# Altium schematic sheet Sheet6.SchDoc
size A4; SheetNumber: 6; SheetTotal: 6
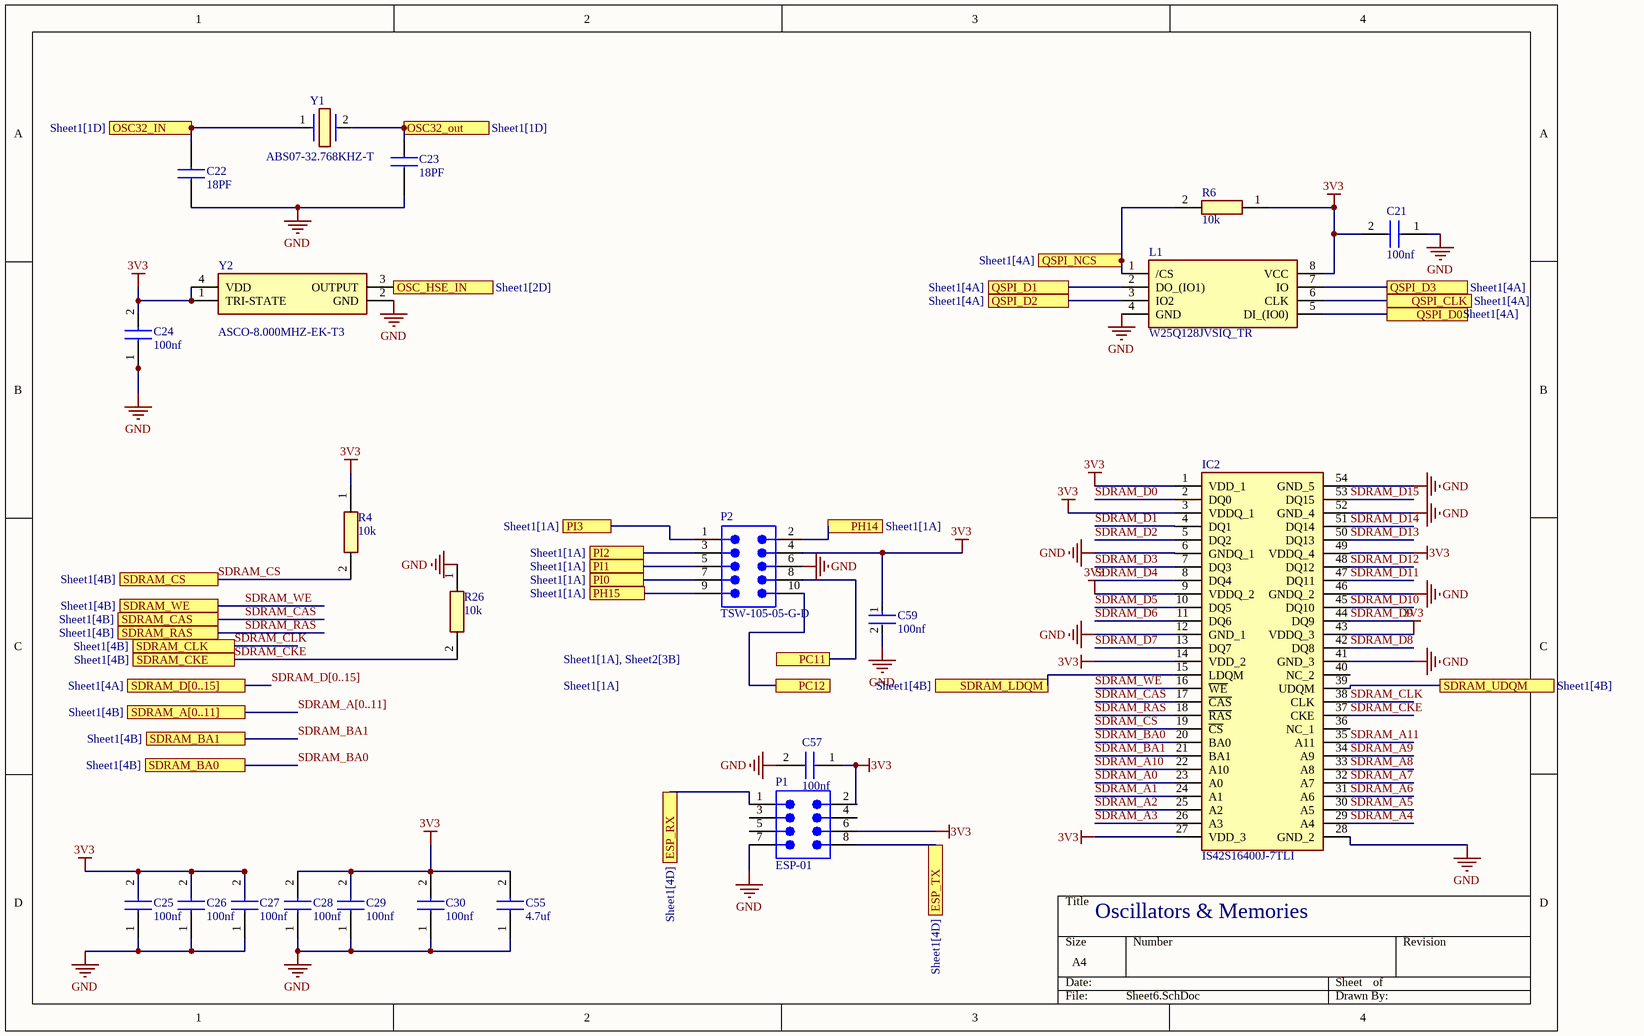
[diagram p0: Sheet6.SchDoc]

## Parts
C21  100nf  [CAPC1608X95N]
C22  18PF  [CAPC1608X87N]
C23  18PF  [CAPC1608X87N]
C24  100nf  [CAPC1608X95N]
C25  100nf  [CAPC1608X95N]
C26  100nf  [CAPC1608X95N]
C27  100nf  [CAPC1608X95N]
C28  100nf  [CAPC1608X95N]
C29  100nf  [CAPC1608X95N]
C30  100nf  [CAPC1608X95N]
C55  4.7uf  [CAPC1608X95N]
C57  100nf  [CAPC1608X95N]
C59  100nf  [FP-VJ0603X-MFG]
IC2  IS42S16400J-7TLI  [SOP80P1176X120-54N]
L1  W25Q128JVSIQ_TR  [SOIC127P780X195-8N]
P1  ESP-01  [SMTC-MTSW-104-12-X-D-006]
P2  TSW-105-05-G-D  [SMTC-TSW-105-05-X-D]
R4  10k  [RESC1608X55N]
R6  10k  [RESC1608X55N]
R26  10k  [RESC1608X55N]
Y1  ABS07-32.768KHZ-T  [ABS07]
Y2  ASCO-8.000MHZ-EK-T3  [ASCO16000MHZEKT]

## Ports
ESP_RX (see Sheet1[4D]), ESP_TX (see Sheet1[4D]), OSC32_IN (see Sheet1[1D]), OSC32_out (see Sheet1[1D]), OSC_HSE_IN (see Sheet1[2D]), PC11 (see Sheet1[1A], Sheet2[3B]), PC12 (see Sheet1[1A]), PH14 (see Sheet1[1A]), PH15 (see Sheet1[1A]), PI0 (see Sheet1[1A]), PI1 (see Sheet1[1A]), PI2 (see Sheet1[1A]), PI3 (see Sheet1[1A]), QSPI_CLK (see Sheet1[4A]), QSPI_D0 (see Sheet1[4A]), QSPI_D1 (see Sheet1[4A]), QSPI_D2 (see Sheet1[4A]), QSPI_D3 (see Sheet1[4A]), QSPI_NCS (see Sheet1[4A]), SDRAM_A[0..11] (see Sheet1[4B]), SDRAM_BA0 (see Sheet1[4B]), SDRAM_BA1 (see Sheet1[4B]), SDRAM_CAS (see Sheet1[4B]), SDRAM_CKE (see Sheet1[4B]), SDRAM_CLK (see Sheet1[4B]), SDRAM_CS (see Sheet1[4B]), SDRAM_D[0..15] (see Sheet1[4A]), SDRAM_LDQM (see Sheet1[4B]), SDRAM_RAS (see Sheet1[4B]), SDRAM_UDQM (see Sheet1[4B]), SDRAM_WE (see Sheet1[4B])

## Nets
3V3: C21.2 C24.2 C25.2 C26.2 C27.2 C28.2 C29.2 C30.2 C55.2 C57.1 C59.1 IC2.1(VDD_1) IC2.3(VDDQ_1) IC2.9(VDDQ_2) IC2.14(VDD_2) IC2.27(VDD_3) IC2.43(VDDQ_3) IC2.49(VDDQ_4) L1.8(VCC) P1.2 P1.6 P2.4 R4.1 R6.1 Y2.1(TRI-STATE) Y2.4(VDD)
GND: C21.1 C22.1 C23.1 C24.1 C25.1 C26.1 C27.1 C28.1 C29.1 C30.1 C55.1 C57.2 C59.2 IC2.6(GNDQ_1) IC2.12(GND_1) IC2.28(GND_2) IC2.41(GND_3) IC2.46(GNDQ_2) IC2.52(GND_4) IC2.54(GND_5) P1.7 P2.6 R26.1 Y2.2(GND)
ESP_RX: P1.1 ; port ESP_RX
ESP_TX: P1.8 ; port ESP_TX
OSC32_IN: C22.2 Y1.1 ; port OSC32_IN
OSC32_out: C23.2 Y1.2 ; port OSC32_out
OSC_HSE_IN: Y2.3(OUTPUT) ; port OSC_HSE_IN
PC11: P2.8 ; port PC11
PC12: P2.10 ; port PC12
PH14: P2.2 ; port PH14
PH15: P2.9 ; port PH15
PI0: P2.7 ; port PI0
PI1: P2.5 ; port PI1
PI2: P2.3 ; port PI2
PI3: P2.1 ; port PI3
QSPI_CLK: L1.6(CLK) ; port QSPI_CLK
QSPI_D0: L1.5(DI_(IO0)) ; port QSPI_D0
QSPI_D1: L1.2(DO_(IO1)) ; port QSPI_D1
QSPI_D2: L1.3(IO2) ; port QSPI_D2
QSPI_D3: L1.7(IO) ; port QSPI_D3
QSPI_NCS: L1.1(/CS) R6.2 ; port QSPI_NCS
SDRAM_A0: IC2.23(A0)
SDRAM_A1: IC2.24(A1)
SDRAM_A2: IC2.25(A2)
SDRAM_A3: IC2.26(A3)
SDRAM_A4: IC2.29(A4)
SDRAM_A5: IC2.30(A5)
SDRAM_A6: IC2.31(A6)
SDRAM_A7: IC2.32(A7)
SDRAM_A8: IC2.33(A8)
SDRAM_A9: IC2.34(A9)
SDRAM_A10: IC2.22(A10)
SDRAM_A11: IC2.35(A11)
SDRAM_BA0: IC2.20(BA0) ; port SDRAM_BA0
SDRAM_BA1: IC2.21(BA1) ; port SDRAM_BA1
SDRAM_CAS: IC2.17(~{CAS}) ; port SDRAM_CAS
SDRAM_CKE: IC2.37(CKE) R26.2 ; port SDRAM_CKE
SDRAM_CLK: IC2.38(CLK) ; port SDRAM_CLK
SDRAM_CS: IC2.19(~{CS}) R4.2 ; port SDRAM_CS
SDRAM_D0: IC2.2(DQ0)
SDRAM_D1: IC2.4(DQ1)
SDRAM_D2: IC2.5(DQ2)
SDRAM_D3: IC2.7(DQ3)
SDRAM_D4: IC2.8(DQ4)
SDRAM_D5: IC2.10(DQ5)
SDRAM_D6: IC2.11(DQ6)
SDRAM_D7: IC2.13(DQ7)
SDRAM_D8: IC2.42(DQ8)
SDRAM_D9: IC2.44(DQ9)
SDRAM_D10: IC2.45(DQ10)
SDRAM_D11: IC2.47(DQ11)
SDRAM_D12: IC2.48(DQ12)
SDRAM_D13: IC2.50(DQ13)
SDRAM_D14: IC2.51(DQ14)
SDRAM_D15: IC2.53(DQ15)
SDRAM_LDQM: IC2.15(LDQM) ; port SDRAM_LDQM
SDRAM_RAS: IC2.18(~{RAS}) ; port SDRAM_RAS
SDRAM_UDQM: IC2.39(UDQM) ; port SDRAM_UDQM
SDRAM_WE: IC2.16(~{WE}) ; port SDRAM_WE

Not connected (* = marked no-connect by the designer): IC2 36(NC_1) 40(NC_2); L1 4(GND); P1 3 4 5

## Buses and harness runs
bus SDRAM_A[0..11] = port SDRAM_A[0..11]
bus SDRAM_D[0..15] = port SDRAM_D[0..15]

## Notes on the sheet
- Oscillators & Memories
- Labels drawn without touching a wire or pin: GND

## Library data of the parts
C21 C24-C30 C55 C57 = VJ0603Y104KXACW1BC: Capacitor; Manufacturer_Name: Vishay; Datasheet Link: https://componentsearchengine.com/Datasheets/2/VJ0603Y104KXACW1BC.pdf; Height: 0.95mm; Manufacturer_Part_Number: VJ0603Y104KXACW1BC; Mouser Part Number: N/A; Mouser Price/Stock: https://www.mouser.co.uk/ProductDetail/Vishay-Vitramon/VJ0603Y104KXACW1BC?qs=M%2FcR%2FDpCXFVPJpohemA31Q%3D%3D; Arrow Part Number: VJ0603Y104KXACW1BC; Arrow Price/Stock: https://www.arrow.com/en/products/vj0603y104kxacw1bc/vishay?utm_currency=USD&region=nac
C22 C23 = C0603C180J5GAC: Multilayer Ceramic Capacitors MLCC - SMD/SMT 50volts 18pF 5% C0G; Manufacturer_Name: KEMET; Geometry.Height: 0.87mm; Manufacturer_Part_Number: C0603C180J5GAC; Mouser Part Number: 80-C0603C180J5GAC; Mouser Price/Stock: https://www.mouser.co.uk/ProductDetail/KEMET/C0603C180J5GAC?qs=zJdl%252BU%252B%2Fz2ks8AeO5ySrAw%3D%3D; Arrow Part Number: *; Arrow Price/Stock: *; Datasheet Link: https://content.kemet.com/datasheets/KEM_C1003_C0G_SMD.pdf
C59 = CMP-02417-000051-1: CAP CER 0.1UF 50V X7R 0603; Tolerance: 10%; Dielectric Material: Tantalum; Capacitance: 100nF; Case/Package: 0603; Construction: Flat; Radiation Hardening: No; Dielectric: X7R; Mount: Surface Mount; Min Operating Temperature: -55°C; Length: 1.6mm; RoHS Compliant: Yes; Case Code (Imperial): 0603; Contact Plating: Tin; Voltage Rating (DC): 50V; Lead Free: Lead Free; Packaging: Cut Tape; Max Operating Temperature: 125°C; Case Code (Metric): 1608; Voltage Rating: 50V; Voltage: 50V; Depth: 0.8mm
IC2 = IS42S16400J-7TLI: Integrated Circuit; Manufacturer_Name: Integrated Silicon Solution Inc.; Datasheet Link: http://www.issi.com/WW/pdf/42-45S16400J.pdf; Height: 1.2mm; Manufacturer_Part_Number: IS42S16400J-7TLI; Mouser Part Number: 870-IS42S16400J-7TLI; Mouser Price/Stock: https://www.mouser.co.uk/ProductDetail/ISSI/IS42S16400J-7TLI?qs=eOmjsnl%2FhF6IYGbICFWNhg%3D%3D; Arrow Part Number: IS42S16400J-7TLI; Arrow Price/Stock: https://www.arrow.com/en/products/is42s16400j-7tli/integrated-silicon-solution-inc?utm_currency=USD&region=nac
L1 = W25Q128JVSIQ_TR: Inductor; Manufacturer_Name: Winbond; Manufacturer_Part_Number: W25Q128JVSIQ TR; Datasheet Link: http://www.winbond.com/resource-files/w25q128jv%20spi%20revc%2011162016.pdf; Height: 1.95mm; Mouser Part Number: 454-W25Q128JVSIQTR; Mouser Price/Stock: https://www.mouser.co.uk/ProductDetail/Winbond/W25Q128JVSIQ-TR?qs=qSfuJ%252Bfl%2Fd7vTyLA9kNdGw%3D%3D; Arrow Part Number: W25Q128JVSIQ TR; Arrow Price/Stock: https://www.arrow.com/en/products/w25q128jvsiqtr/winbond-electronics?utm_currency=USD&region=nac
P1 = CMP-1024-00110-1: Modified .025" SQ Post Header, Through-hole, Vertical, -55 to 105 degC, 2.54 mm Pitch, 8-Pin, Male, RoHS; PartNumber: MTSW-104-12-T-D-006; Manufacturer: Samtec; Pitch: 2.54 mm; ComponentLink3URL: http://www.samtec.com/documents/webfiles/cpdf/MTSW-XXX-XX-X-X-XXXX-XX-XXX-MKT1.pdf; Temperature Range: -55 to 105 degC; Orientation: Vertical; ComponentLink1URL: http://www.samtec.com; PackageDescription: Assembly .025" [.64] SQ Post Terminal Strip; ComponentLink3Description: Package Specification; ComponentLink2URL: http://www.samtec.com/documents/webfiles/pdf/MTSW.PDF; ComponentLink2Description: Datasheet; PackageReference: MTSW-104-12-X-D-006; DatasheetVersion: F-214; Mounting Technology: Through-hole; RoHS: True; PackageVersion: BI, 2/1987; ComponentLink1Description: Manufacturer URL
P2 = CMP-1024-00362-1: 0.025" SQ Post Header, Through-hole, Vertical, -55 to 125 degC, 2.54 mm Pitch, 10-Pin, Male, RoHS; Manufacturer: Samtec; Pitch: 2.54 mm; Temperature Range: -55 to 125 degC; ComponentLink3URL: http://www.samtec.com/documents/webfiles/cpdf/TSW-XXX-XX-XXX-X-XX-XXX-MKT.pdf; ComponentLink2Description: Datasheet; Mounting Technology: Through-hole; ComponentLink3Description: Package Specification; RoHS: True; ComponentLink1URL: http://www.samtec.com; PackageVersion: DM, 8/1988; PartNumber: TSW-105-05-G-D; PackageReference: TSW-105-05-X-D; DatasheetVersion: F-214; ComponentLink2URL: http://www.samtec.com/documents/webfiles/pdf/TSW_TH.PDF; PackageDescription: .025[0.64] SQ. Post Terminal Strip Assembly; Orientation: Vertical; ComponentLink1Description: Manufacturer URL
R4 R6 R26 = RC0603FR-071KL: Resistor; Manufacturer_Name: YAGEO; Datasheet Link: https://www.yageo.com/upload/media/product/productsearch/datasheet/rchip/PYu-RC_Group_51_RoHS_L_12.pdf; Height: 0.55mm; Manufacturer_Part_Number: RC0603FR-071KL; Mouser Part Number: 603-RC0603FR-071KL; Mouser Price/Stock: https://www.mouser.co.uk/ProductDetail/YAGEO/RC0603FR-071KL?qs=VU8sRB4EgwApHsk4rF%2F3zg%3D%3D; Arrow Part Number: RC0603FR-071KL; Arrow Price/Stock: https://www.arrow.com/en/products/rc0603fr-071kl/yageo?utm_currency=USD&region=nac
Y1 = ABS07-32.768KHZ-T: Crystal or Oscillator; Manufacturer_Name: ABRACON; Datasheet Link: https://abracon.com/Resonators/ABS07.pdf; Height: 0.9mm; Manufacturer_Part_Number: ABS07-32.768KHZ-T; Mouser Part Number: 815-ABS07-32.768KHZT; Mouser Price/Stock: https://www.mouser.co.uk/ProductDetail/ABRACON/ABS07-32.768KHZ-T?qs=3SpAxaLJ01g8GJWeO3sA3Q%3D%3D; Arrow Part Number: ABS07-32.768KHZ-T; Arrow Price/Stock: https://www.arrow.com/en/products/abs07-32.768khz-t/abracon?utm_currency=USD&region=europe
Y2 = ASCO-8.000MHZ-EK-T3: Crystal or Oscillator; Manufacturer_Name: ABRACON; Datasheet Link: https://abracon.com/Oscillators/ASCO.pdf; Height: 0mm; Manufacturer_Part_Number: ASCO-8.000MHZ-EK-T3; Mouser Part Number: 815-ASCO-8-EK-T3; Mouser Price/Stock: https://www.mouser.co.uk/ProductDetail/ABRACON/ASCO-8000MHZ-EK-T3?qs=DffVzuaNd2xxqtOgFaJTHg%3D%3D; Arrow Part Number: ASCO-8.000MHZ-EK-T3; Arrow Price/Stock: https://www.arrow.com/en/products/asco-8.000mhz-ek-t3/abracon?utm_currency=USD&region=nac